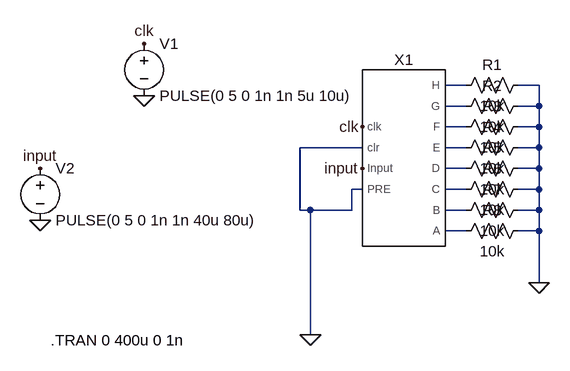
[diagram p0: schematic test_shiftregister.asc]
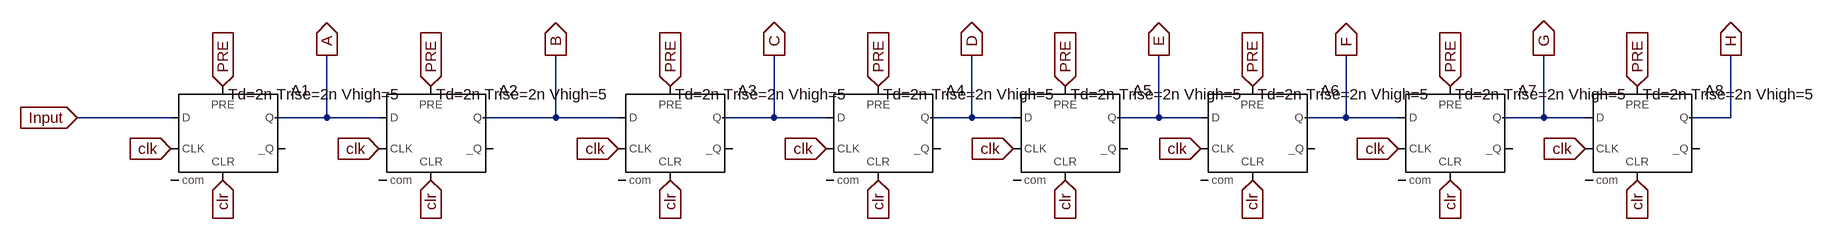
[diagram p1: sub-circuit shift_register.asc]
test_shiftregister.asc, the LTspice schematic file:
Version 4.1
SHEET 1 880 680
WIRE 256 64 224 64
WIRE 368 64 336 64
WIRE 256 96 224 96
WIRE 368 96 368 64
WIRE 368 96 336 96
WIRE 256 128 224 128
WIRE 368 128 368 96
WIRE 368 128 336 128
WIRE 96 160 0 160
WIRE 256 160 224 160
WIRE 368 160 368 128
WIRE 368 160 336 160
WIRE 256 192 224 192
WIRE 368 192 368 160
WIRE 368 192 336 192
WIRE 96 224 80 224
WIRE 256 224 224 224
WIRE 368 224 368 192
WIRE 368 224 336 224
WIRE 0 256 0 160
WIRE 16 256 0 256
WIRE 80 256 80 224
WIRE 80 256 16 256
WIRE 256 256 224 256
WIRE 368 256 368 224
WIRE 368 256 336 256
WIRE 256 288 224 288
WIRE 368 288 368 256
WIRE 368 288 336 288
WIRE 368 368 368 288
WIRE 16 448 16 256
FLAG 368 368 0
FLAG -240 80 0
FLAG -400 272 0
FLAG -240 0 clk
FLAG 96 128 clk
FLAG -400 192 input
FLAG 96 192 input
FLAG 16 448 0
SYMBOL res 352 48 R90
WINDOW 0 0 56 VBottom 2
WINDOW 3 32 56 VTop 2
SYMATTR InstName R1
SYMATTR Value 10k
SYMBOL res 352 80 R90
WINDOW 0 0 56 VBottom 2
WINDOW 3 32 56 VTop 2
SYMATTR InstName R2
SYMATTR Value 10k
SYMBOL res 352 112 R90
WINDOW 0 0 56 VBottom 2
WINDOW 3 32 56 VTop 2
SYMATTR InstName R3
SYMATTR Value 10k
SYMBOL res 352 144 R90
WINDOW 0 0 56 VBottom 2
WINDOW 3 32 56 VTop 2
SYMATTR InstName R4
SYMATTR Value 10k
SYMBOL res 352 176 R90
WINDOW 0 0 56 VBottom 2
WINDOW 3 32 56 VTop 2
SYMATTR InstName R5
SYMATTR Value 10k
SYMBOL res 352 208 R90
WINDOW 0 0 56 VBottom 2
WINDOW 3 32 56 VTop 2
SYMATTR InstName R6
SYMATTR Value 10k
SYMBOL res 352 240 R90
WINDOW 0 0 56 VBottom 2
WINDOW 3 32 56 VTop 2
SYMATTR InstName R7
SYMATTR Value 10k
SYMBOL res 352 272 R90
WINDOW 0 0 56 VBottom 2
WINDOW 3 32 56 VTop 2
SYMATTR InstName R8
SYMATTR Value 10k
SYMBOL voltage -240 -16 R0
WINDOW 123 0 0 Left 0
WINDOW 39 0 0 Left 0
SYMATTR InstName V1
SYMATTR Value PULSE(0 5 0 1n 1n 5u 10u)
SYMBOL voltage -400 176 R0
WINDOW 123 0 0 Left 0
WINDOW 39 0 0 Left 0
SYMATTR InstName V2
SYMATTR Value PULSE(0 5 0 1n 1n 40u 80u)
SYMBOL shift_register 160 176 R0
SYMATTR InstName X1
TEXT -384 456 Left 2 !.TRAN 0 400u 0 1n

shift_register.asc, the sub-circuit schematic file:
Version 4.1
SHEET 1 2264 680
WIRE -320 112 -464 112
WIRE -80 112 -80 16
WIRE -80 112 -160 112
WIRE 0 112 -80 112
WIRE 272 112 272 16
WIRE 272 112 160 112
WIRE 368 112 272 112
WIRE 608 112 608 16
WIRE 608 112 528 112
WIRE 688 112 608 112
WIRE 912 112 912 16
WIRE 912 112 848 112
WIRE 976 112 912 112
WIRE 1200 112 1200 16
WIRE 1200 112 1136 112
WIRE 1264 112 1200 112
WIRE 1488 112 1488 16
WIRE 1488 112 1424 112
WIRE 1568 112 1488 112
WIRE 1792 112 1792 16
WIRE 1792 112 1728 112
WIRE 1856 112 1792 112
WIRE 2080 112 2080 16
WIRE 2080 112 2016 112
FLAG 0 160 clk
IOPIN 0 160 In
FLAG 368 160 clk
IOPIN 368 160 In
FLAG -320 160 clk
IOPIN -320 160 In
FLAG 688 160 clk
IOPIN 688 160 In
FLAG 976 160 clk
IOPIN 976 160 In
FLAG 1264 160 clk
IOPIN 1264 160 In
FLAG 1568 160 clk
IOPIN 1568 160 In
FLAG 1856 160 clk
IOPIN 1856 160 In
FLAG -240 208 clr
IOPIN -240 208 In
FLAG 80 208 clr
IOPIN 80 208 In
FLAG 448 208 clr
IOPIN 448 208 In
FLAG 768 208 clr
IOPIN 768 208 In
FLAG 1056 208 clr
IOPIN 1056 208 In
FLAG 1344 208 clr
IOPIN 1344 208 In
FLAG 1648 208 clr
IOPIN 1648 208 In
FLAG 1936 208 clr
IOPIN 1936 208 In
FLAG -464 112 Input
IOPIN -464 112 In
FLAG -80 16 A
IOPIN -80 16 Out
FLAG 272 16 B
IOPIN 272 16 Out
FLAG 608 16 C
IOPIN 608 16 Out
FLAG 912 16 D
IOPIN 912 16 Out
FLAG 1200 16 E
IOPIN 1200 16 Out
FLAG 1488 16 F
IOPIN 1488 16 Out
FLAG 1792 16 G
IOPIN 1792 16 Out
FLAG 2080 16 H
IOPIN 2080 16 Out
FLAG -240 64 PRE
IOPIN -240 64 In
FLAG 80 64 PRE
IOPIN 80 64 In
FLAG 448 64 PRE
IOPIN 448 64 In
FLAG 768 64 PRE
IOPIN 768 64 In
FLAG 1056 64 PRE
IOPIN 1056 64 In
FLAG 1344 64 PRE
IOPIN 1344 64 In
FLAG 1648 64 PRE
IOPIN 1648 64 In
FLAG 1936 64 PRE
IOPIN 1936 64 In
SYMBOL Digital\\dflop -240 64 R0
WINDOW 39 8 12 Left 2
SYMATTR SpiceLine Td=2n Trise=2n Vhigh=5
SYMATTR InstName A1
SYMBOL Digital\\dflop 80 64 R0
WINDOW 39 8 12 Left 2
SYMATTR SpiceLine Td=2n Trise=2n Vhigh=5
SYMATTR InstName A2
SYMBOL Digital\\dflop 448 64 R0
WINDOW 39 8 12 Left 2
SYMATTR SpiceLine Td=2n Trise=2n Vhigh=5
SYMATTR InstName A3
SYMBOL Digital\\dflop 768 64 R0
WINDOW 39 8 12 Left 2
SYMATTR SpiceLine Td=2n Trise=2n Vhigh=5
SYMATTR InstName A4
SYMBOL Digital\\dflop 1056 64 R0
WINDOW 39 8 12 Left 2
SYMATTR SpiceLine Td=2n Trise=2n Vhigh=5
SYMATTR InstName A5
SYMBOL Digital\\dflop 1344 64 R0
WINDOW 39 8 12 Left 2
SYMATTR SpiceLine Td=2n Trise=2n Vhigh=5
SYMATTR InstName A6
SYMBOL Digital\\dflop 1648 64 R0
WINDOW 39 8 12 Left 2
SYMATTR SpiceLine Td=2n Trise=2n Vhigh=5
SYMATTR InstName A7
SYMBOL Digital\\dflop 1936 64 R0
WINDOW 39 8 12 Left 2
SYMATTR SpiceLine Td=2n Trise=2n Vhigh=5
SYMATTR InstName A8

The netlist it stands for:
* test_shiftregister.asc
R1 0 N001 10k
R2 0 N002 10k
R3 0 N003 10k
R4 0 N004 10k
R5 0 N005 10k
R6 0 N006 10k
R7 0 N007 10k
R8 0 N008 10k
V1 clk 0 PULSE(0 5 0 1n 1n 5u 10u)
V2 input 0 PULSE(0 5 0 1n 1n 40u 80u)
X§X1 clk 0 input 0 N001 N002 N003 N004 N005 N006 N007 N008 shift_register

* block symbol definitions
.subckt shift_register clk clr Input PRE H G F E D C B A
A1 Input 0 clk PRE clr 0 A 0 DFLOP Td=2n Trise=2n Vhigh=5
A2 A 0 clk PRE clr 0 B 0 DFLOP Td=2n Trise=2n Vhigh=5
A3 B 0 clk PRE clr 0 C 0 DFLOP Td=2n Trise=2n Vhigh=5
A4 C 0 clk PRE clr 0 D 0 DFLOP Td=2n Trise=2n Vhigh=5
A5 D 0 clk PRE clr 0 E 0 DFLOP Td=2n Trise=2n Vhigh=5
A6 E 0 clk PRE clr 0 F 0 DFLOP Td=2n Trise=2n Vhigh=5
A7 F 0 clk PRE clr 0 G 0 DFLOP Td=2n Trise=2n Vhigh=5
A8 G 0 clk PRE clr 0 H 0 DFLOP Td=2n Trise=2n Vhigh=5
.ends shift_register

.TRAN 0 400u 0 1n
.backanno
.end